# EAGLE design relay_edit (EAGLE 9.6.2)
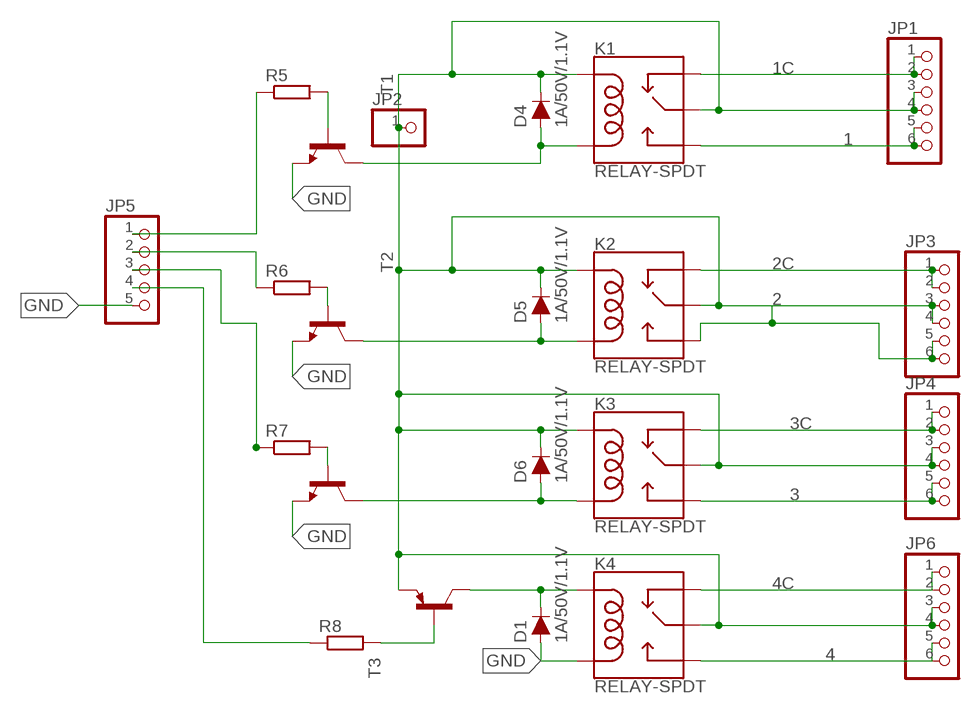
[diagram p0: schematic, sheet 1]

## Parts
D1  1A/50V/1.1V  DIODE-PTH  [DIODE-1N4001]
D4  1A/50V/1.1V  DIODE-PTH  [DIODE-1N4001]
D5  1A/50V/1.1V  DIODE-PTH  [DIODE-1N4001]
D6  1A/50V/1.1V  DIODE-PTH  [DIODE-1N4001]
JP1  PINHD-1X6  [1X06]
JP2  PINHD-1X1  [1X01]
JP3  PINHD-1X6  [1X06]
JP4  PINHD-1X6  [1X06]
JP5  PINHD-1X5  [1X05]
JP6  PINHD-1X6  [1X06]
K1  RELAY-SPDT  [RELAY_G5LE]
K2  RELAY-SPDT  [RELAY_G5LE]
K3  RELAY-SPDT  [RELAY_G5LE]
K4  RELAY-SPDT  [RELAY_G5LE]
R5  R-EU_0204/5  [0204/5]
R6  R-EU_0204/5  [0204/5]
R7  R-EU_0204/5  [0204/5]
R8  R-EU_0204/5  [0204/5]
T1  2N5401-NPN-TO92-CBE  [TO92-CBE]
T2  2N5401-NPN-TO92-CBE  [TO92-CBE]
T3  2N4126-PNP-TO92-CBE  [TO92-CBE]
T4  2N5401-NPN-TO92-CBE  [TO92-CBE]

## Nets
1: JP1.5 JP1.6 K1.3(NO)
1C: JP1.1 JP1.2 K1.4(NC)
2: JP3.5 JP3.6 K2.3(NO)
2C: JP3.1 JP3.2 K2.4(NC)
3: JP4.5 JP4.6 K3.3(NO)
3C: JP4.1 JP4.2 K3.4(NC)
4: JP6.5 JP6.6 K4.3(NO)
4C: JP6.1 JP6.2 K4.4(NC)
124: D6.A K3.5(COIL2) T4.C
GND: D1.A JP5.5 K4.5(COIL2) T1.E T2.E T4.E
N$5: D5.A K2.5(COIL2) T2.C
N$6: D4.A K1.5(COIL2) T1.C
N$7: R6.2 T2.B
N$8: D4.C D5.C D6.C JP1.3 JP1.4 JP2.1 JP3.3 JP3.4 JP4.3 JP4.4 JP6.3 JP6.4 K1.1(MAIN) K1.2(COIL1) K2.1(MAIN) K2.2(COIL1) K3.1(MAIN) K3.2(COIL1) K4.1(MAIN) T3.E
N$9: R8.2 T3.B
N$10: JP5.3 R7.1
N$11: JP5.2 R6.1
N$12: JP5.1 R5.1
N$13: R5.2 T1.B
N$19: D1.C K4.2(COIL1) T3.C
N$21: R7.2 T4.B
N$23: JP5.4 R8.1

## Library data of the parts
D1 D4-D6 = SparkFun-DiscreteSemi:DIODE: Diode These are standard reverse protection diodes and small signal diodes. SparkFun Products: SparkFun SparkPunk Sound Kit <https://www.sparkfun.com/products/11177> SparkFun ESP8266 Thing <https://www.sparkfun.com/products/13231>; PROD_ID: DIO-09176
JP1 JP3 JP4 JP6 = pinhead:PINHD-1X6: PIN HEADER
JP2 = pinhead:PINHD-1X1: PIN HEADER
JP5 = pinhead:PINHD-1X5: PIN HEADER
K1-K4 = SparkFun-Electromechanical:RELAY-SPDT: SPDT Electromechanical Relay Single-pole, double-throw sealed relays. When current is applied to the coil, it throws a simple changeover switch, terminating the connection from the NC contact to ground and closing the NO contact. Use them to switch high voltage/high current devices. SparkFun Products JQX-15F: Relay SPDT Sealed - 20A <https://www.sparkfun.com/products/10924> (COM-10924) JZC-11F: Relay SPDT Sealed <https://www.sparkfun.com/products/100> (COM-00100); PROD_ID: COMP-14214
R5-R8 = rcl:R-EU_: RESISTOR, European symbol; SPICEPREFIX: R
T1 = transistor:*-NPN-: NPN Transistror BF959 corrected 2008.03.06
T2 T4 = transistor:*-NPN-: NPN Transistror BF959 corrected 2008.03.06; SPICEPREFIX: J
T3 = transistor:*-PNP-: PNP Transistror

## Board
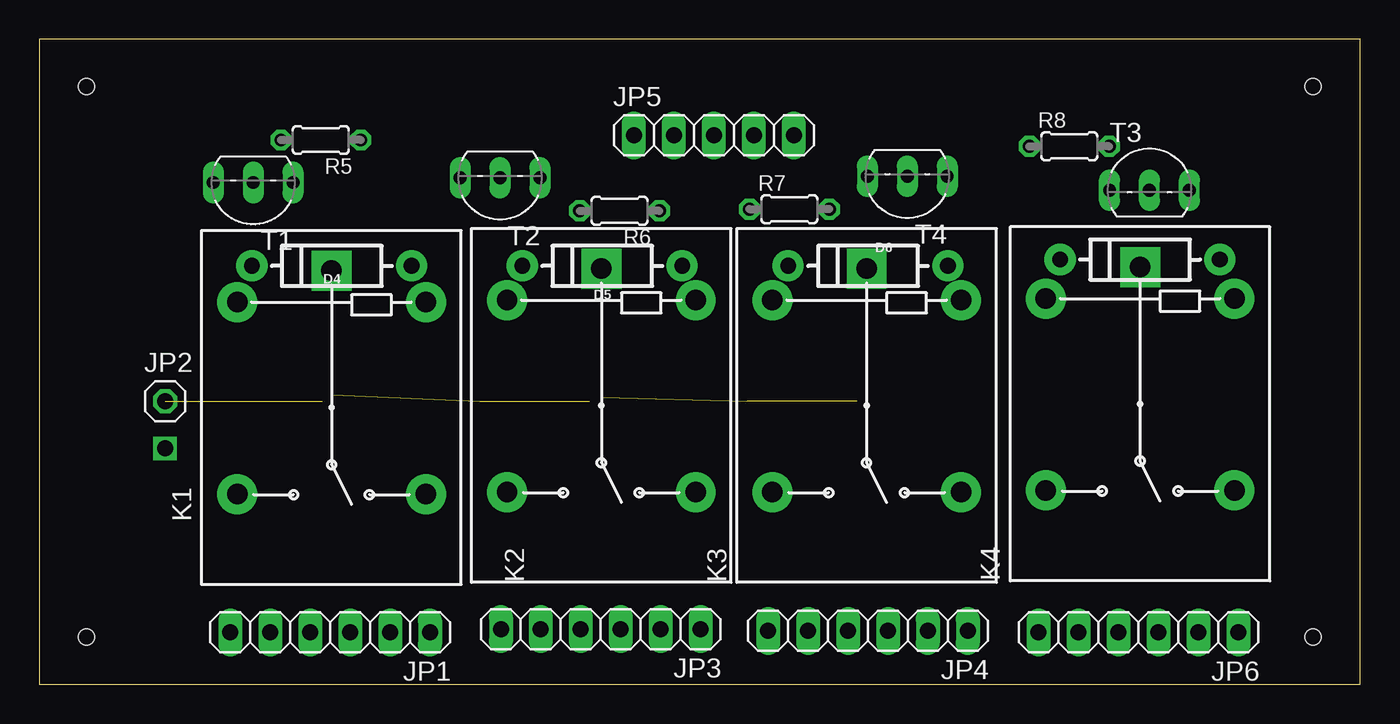
[diagram p1: board, top side]
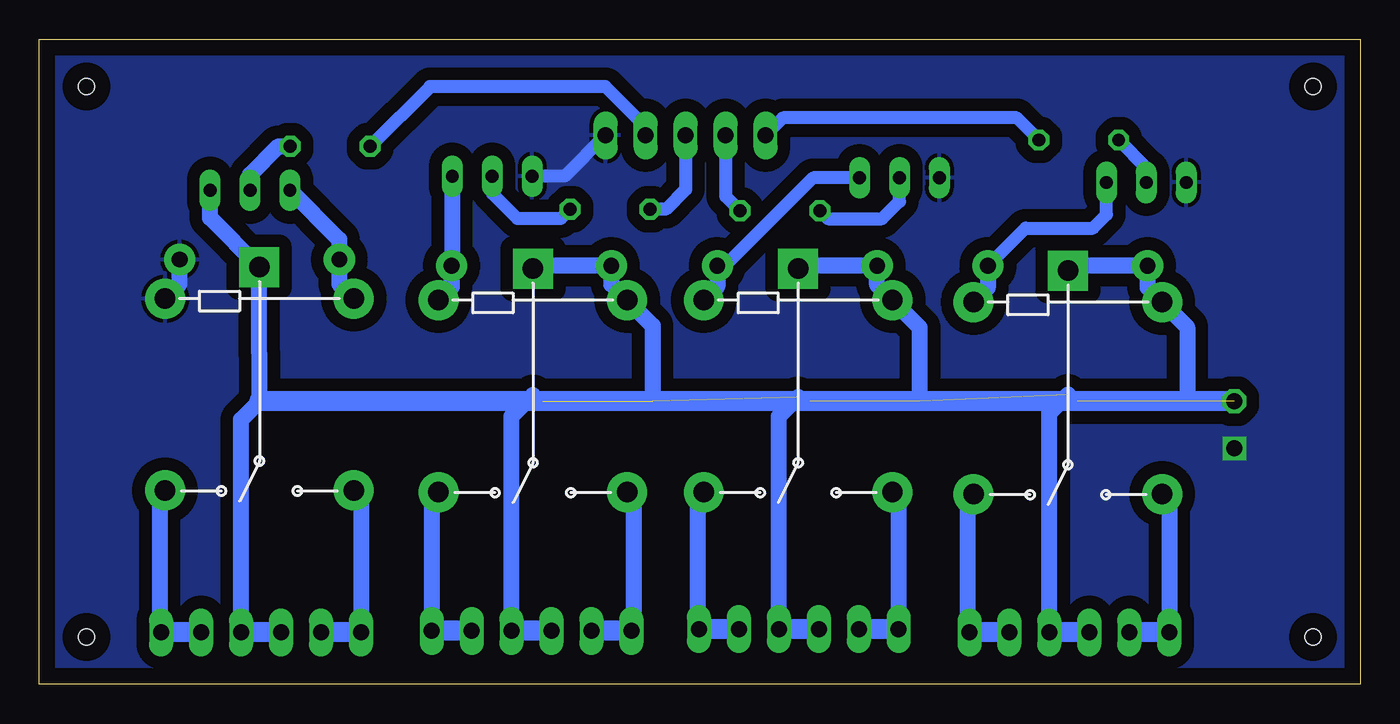
[diagram p2: board, bottom side, seen from below]

Size 84 x 41 mm. Coordinates in mm from the lower left corner, seen from the top.
Outline: 0,0 84,0 84,41 0,41 0,0
Copper layers (1*16): Top 0.035mm / dielectric 1.5mm / Bottom 0.035mm
Design rules "default": minimum track width 6mil, minimum drill 0.35mm, track to track 6mil, track to pad 6mil, pad to pad 6mil, via to via 6mil, smd to smd 6mil, copper to edge 40mil, drill to drill 6mil, minimum pad ring 10mil, minimum via ring 8mil, stop-mask expansion 4mil, vias tented up to drill 0mil, thermal gap 10mil
Holes 1 mm at 3,38 3,3 81,38 81,3

### Footprints (pad centres in the part's own frame; a part is rotated, then mirrored left to right if it is on the bottom)
DIODE-1N4001 = drill 1 pad 1.981: A -5.08,0; C 5.08,0
1X06 = drill 1.016 long: 1 -6.35,0; 2 -3.81,0; 3 -1.27,0; 4 1.27,0; 5 3.81,0; 6 6.35,0
1X01 = drill 1.016 octagon: 1 0,0
1X05 = drill 1.016 long: 1 -5.08,0; 2 -2.54,0; 3 0,0; 4 2.54,0; 5 5.08,0
RELAY_G5LE = drill 1.3 pad 2.54 square: 1 8.52,-0.005 | drill 1.3 pad 2.54: 2 6.52,5.995; 3 -5.68,5.995; 4 -5.68,-6.005; 5 6.52,-6.005
0204/5 = drill 0.813 octagon: 1 -2.54,0; 2 2.54,0
TO92-CBE = drill 0.813 long: B 0,0; C -2.54,0; E 2.54,0

### Placement (x,y rotation side)
D1  70,27 180 top
D4  18.6,26.6 180 top
D5  35.8,26.6 180 top
D6  52.7,26.6 180 top
JP1  18.5,3.3 180 top
JP2  8,18 0 top
JP3  35.7,3.5 180 top
JP4  52.7,3.4 180 top
JP5  42.9,34.9 0 top
JP6  69.9,3.3 180 top
K1  18.58,17.77 90 top
K2  35.74,17.9 90 top
K3  52.61,17.9 90 top
K4  70,18 90 top
R5  17.9,34.6 180 top
R6  36.9,30.1 180 top
R7  47.7,30.2 0 top
R8  65.5,34.2 0 top
T1  13.6,31.9 180 top
T2  29.3,32.2 180 top
T3  70.6,31.4 0 top
T4  55.2,32.3 180 top

### Tracks (layer width: path | path; a pad name or v marks a point on that pad's centre or on a via)
1
  Bottom 1.016: K1.3 12.15,11.66 JP1.6
  Bottom 1.27: JP1.6 JP1.5
1C
  Bottom 1.016: K1.4 24.98,11.69 24.98,3.44 JP1.1
  Bottom 1.27: JP1.2 JP1.1
2
  Bottom 1.016: K2.3 29.35,11.83 JP3.6
  Bottom 1.27: JP3.6 JP3.5
2C
  Bottom 1.016: K2.4 42.15,11.81 42.15,3.6 JP3.1
  Bottom 1.27: JP3.2 JP3.1
3
  Bottom 1.016: K3.3 46.22,11.82 46.22,3.53 JP4.6
  Bottom 1.27: JP4.6 JP4.5
3C
  Bottom 1.016: K3.4 59.05,11.78 JP4.1
  Bottom 1.27: JP4.2 JP4.1
4
  Bottom 1.016: K4.3 63.55,11.87 JP6.6
  Bottom 1.27: JP6.6 JP6.5
4C
  Bottom 1.016: K4.4 76.35,11.98 76.35,3.4 JP6.1
  Bottom 1.27: JP6.2 JP6.1
124
  Bottom 1.016: K3.5 57.78,25.26 D6.A 57.74,26.64 T4.C
GND  (via drill 1 pad 1.3)
  Bottom 0.813: JP5.5 50.58,32.3 T4.E
  Bottom 1.016: K4.5 75.08,25.45 D1.A
  other vias: 8,15
  pour Bottom (isolate 0.813): 0,41 0,0 84,0 84,41
N$5
  Bottom 0.813: T2.C 34.8,32.2 40.4,26.6 D5.A
  Bottom 1.016: D5.A 40.88,25.28 K2.5
N$6
  Bottom 0.813: D4.A 21.28,29 17,29 16.14,29.86 T1.C
  Bottom 1.016: D4.A 23.68,25.2 K1.5
N$7
  Bottom 0.813: R6.2 33.86,29.6 30.4,29.6 29.3,30.7 T2.B
N$8  (6 unrouted)
  Bottom 1.016: 18,18 19,18 | 35,18 36,18 | 52,18 53,18 | 53,18 52.62,18.38 | 36,18 35.74,18.26 | 19,18 18.59,18.41 | 28,18 28,22.67 K2.2 30.72,25.4 D5.C 35.56,26.6 K2.1 | 11,18 11,22.7 K1.2 13.52,25.23 D4.C 18.27,26.6 K1.1 | 45,18 45,22.8 K3.2 47.62,25.42 D6.C 52.44,26.6 K3.1 | T3.E 73.14,29.66 K4.1 70,21.01 70,21 70,18 71.17,16.83 JP6.3 | JP4.3 53.97,17.03 53,18 | JP3.3 36.97,17.03 36,18 | JP1.3 19.77,17.23 19,18
  Bottom 1.27: JP6.4 JP6.3 | JP1.4 JP1.3 | JP3.4 JP3.3 | JP4.4 JP4.3 | JP2.1 70,18
N$9
  Bottom 1.016: T3.B 70.6,32.4 68.8,34.2 R8.2
N$10
  Bottom 0.813: JP5.3 42.9,31.46 44.16,30.2 R7.1
N$11
  Bottom 0.813: JP5.2 40.36,31.02 R6.1
N$12
  Bottom 0.813: R5.1 21.84,36 36.72,36 JP5.1
N$13
  Bottom 0.813: R5.2 13.6,32.84 T1.B
N$19
  Bottom 1.016: T3.C 64.92,28.26 D1.C 64.92,25.44 K4.2
N$21
  Bottom 0.813: R7.2 50.84,29.6 53.6,29.6 55.2,31.2 T4.B
N$23
  Bottom 0.813: JP5.4 45.44,35.44 48,38 59.16,38 R8.1